# EAGLE design power (EAGLE 6.6.0)

## Sheet 1 of 2
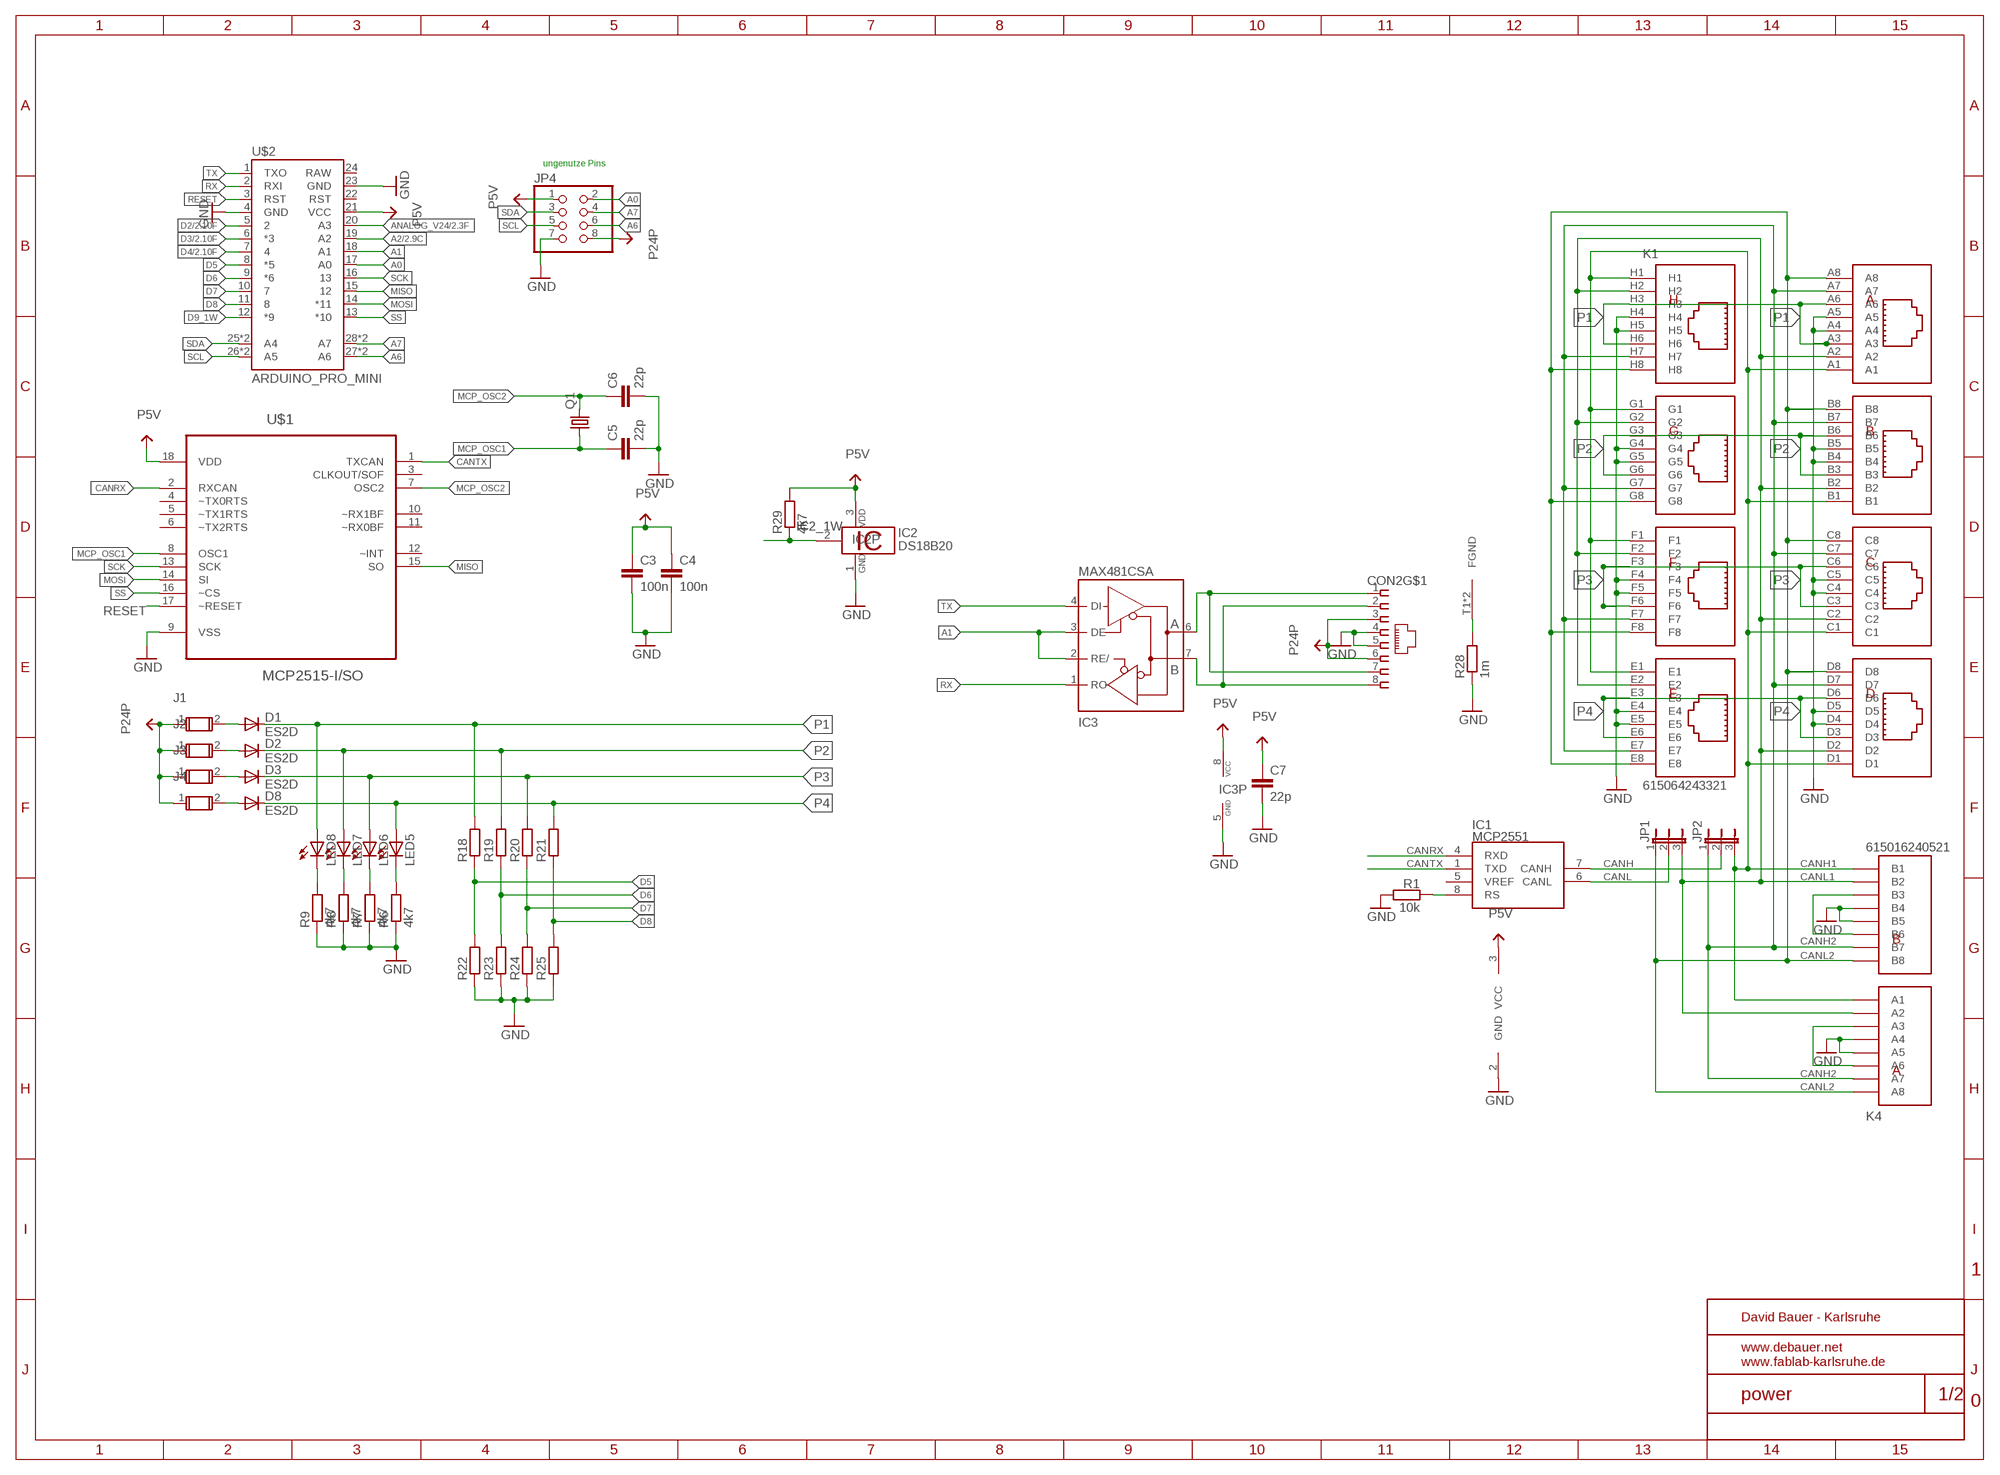
[diagram p0: schematic, sheet 1]

### Parts
C3  100n  C-EUC0805  [C0805]
C4  100n  C-EUC0805  [C0805]
C5  22p  C-EUC0805  [C0805]
C6  22p  C-EUC0805  [C0805]
C7  22p  C-EUC0805  [C0805]
CON2  MEBP_8-8G  [MEBP]
D1  ES2D  [SMB]
D2  ES2D  [SMB]
D3  ES2D  [SMB]
D8  ES2D  [SMB]
IC1  MCP2551  [SO-8]
IC2  DS18B20  [TO92-]
IC3  MAX481CSA  [SO08]
J1  696101000002  [696101000002]
J2  696101000002  [696101000002]
J3  696101000002  [696101000002]
J4  696101000002  [696101000002]
JP1  JP2E  [JP2]
JP2  JP2E  [JP2]
JP4  PINHD-2X4  [2X04]
K1  615064243321  [615064243321]
K4  615016240521  [615016240521]
LED5  LED3MM  [LED3MM]
LED6  LED3MM  [LED3MM]
LED7  LED3MM  [LED3MM]
LED8  LED3MM  [LED3MM]
Q1  CRYSTALHC49S  [HC49/S]
R1  10k  R-EU_R0603  [R0603]
R6  4k7  R-EU_R0805  [R0805]
R7  4k7  R-EU_R0805  [R0805]
R8  4k7  R-EU_R0805  [R0805]
R9  4k7  R-EU_R0805  [R0805]
R18  R-EU_R0805  [R0805]
R19  R-EU_R0805  [R0805]
R20  R-EU_R0805  [R0805]
R21  R-EU_R0805  [R0805]
R22  R-EU_R0805  [R0805]
R23  R-EU_R0805  [R0805]
R24  R-EU_R0805  [R0805]
R25  R-EU_R0805  [R0805]
R28  1m  R-EU_R0805  [R0805]
R29  4k7  R-EU_R0805  [R0805]
U$1  MCP2515-I/SO  [SOIC127P1034X264-18N]
U$2  ARDUINO_PRO_MINI  [ARDUINO_PRO_MINI]

### Nets
A0: JP4.2 U$2.17(A0)
A1: IC3.2(RE/) IC3.3(DE) U$2.18(A1)
A2: U$2.19(A2) ; also sheet 2
A6: JP4.6 U$2.27(A6) U$2.A6
A7: JP4.4 U$2.28(A7) U$2.A7
ANALOG_V24: U$2.20(A3) ; also sheet 2
CANH: IC1.7(CANH) JP2.2
CANH1: JP2.3 K1.A1 K1.B1 K1.C1 K1.D1 K1.E1 K1.F1 K1.G1 K1.H1 K4.A1 K4.B1
CANH2: JP2.1 K1.A7 K1.B7 K1.C7 K1.D7 K1.E7 K1.F7 K1.G7 K1.H7 K4.A7 K4.B7
CANL: IC1.6(CANL) JP1.2
CANL1: JP1.3 K1.A2 K1.B2 K1.C2 K1.D2 K1.E2 K1.F2 K1.G2 K1.H2 K4.A2 K4.B2
CANL2: JP1.1 K1.A8 K1.B8 K1.C8 K1.D8 K1.E8 K1.F8 K1.G8 K1.H8 K4.A8 K4.B8
CANRX: IC1.4(RXD) U$1.2(RXCAN)
CANTX: IC1.1(TXD) U$1.1(TXCAN)
D2: U$2.5 ; also sheet 2
D3: U$2.6(*3) ; also sheet 2
D4: U$2.7 ; also sheet 2
D5: R18.1 R22.2 U$2.8(*5)
D6: R19.1 R23.2 U$2.9(*6)
D7: R20.1 R24.2 U$2.10
D8: R21.1 R25.2 U$2.11
D9_1W: IC2.2 R29.1 U$2.12(*9)
GND: C3.2 C4.2 C5.2 C6.2 C7.2 CON2.4 CON2.5 IC1.2(GND) IC2.1 IC3.5(GND) JP4.7 K1.A4 K1.A5 K1.B4 K1.B5 K1.C4 K1.C5 K1.D4 K1.D5 K1.E4 K1.E5 K1.F4 K1.F5 K1.G4 K1.G5 K1.H4 K1.H5 K4.A4 K4.A5 K4.B4 K4.B5 R1.2 R6.1 R7.1 R8.1 R9.1 R22.1 R23.1 R24.1 R25.1 R28.1 U$1.9(VSS) U$2.4(GND) U$2.23(GND) ; also sheet 2
MCP_OSC1: C5.1 Q1.1 U$1.8(OSC1)
MCP_OSC2: C6.1 Q1.2 U$1.7(OSC2)
MISO: U$1.15(SO) U$2.15
MOSI: U$1.14(SI) U$2.14(*11)
N$1: IC1.8(RS) R1.1
N$2: K4.B3 K4.B6
N$3: CON2.T1(FGND) CON2.T2(FGND) R28.2
N$5: D1.A J1.2
N$6: K4.A3 K4.A6
N$7: D2.A J2.2
N$12: D3.A J3.2
N$20: LED5.K(C) R6.2
N$21: LED6.K(C) R7.2
N$22: D8.A J4.2
N$23: LED7.K(C) R8.2
N$24: LED8.K(C) R9.2
P1: D1.C K1.A3 K1.A6 K1.H3 K1.H6 LED8.A R18.2
P2: D2.C K1.B3 K1.B6 K1.G3 K1.G6 LED7.A R19.2
P3: D3.C K1.C3 K1.C6 K1.F3 K1.F6 LED6.A R20.2
P4: D8.C K1.D3 K1.D6 K1.E3 K1.E6 LED5.A R21.2
P5V: C3.1 C4.1 C7.1 IC1.3(VCC) IC2.3 IC3.8(VCC) JP4.1 R29.2 U$1.18(VDD) U$2.21(VCC) ; also sheet 2
P24P: CON2.3 CON2.6 J1.1 J2.1 J3.1 J4.1 JP4.8 ; also sheet 2
RESET: U$1.17(~RESET) U$2.3(RST)
RS485_A: CON2.1 CON2.7 IC3.6(A)
RS485_B: CON2.2 CON2.8 IC3.7(B)
RX: IC3.1(RO) U$2.2(RXI)
SCK: U$1.13(SCK) U$2.16
SCL: JP4.5 U$2.26(A5) U$2.A5
SDA: JP4.3 U$2.25(A4) U$2.A4
SS: U$1.16(~CS) U$2.13(*10)
TX: IC3.4(DI) U$2.1(TXO)
Unconnected: IC1.5(VREF) U$1.3(CLKOUT/SOF) U$1.4(~TX0RTS) U$1.5(~TX1RTS) U$1.6(~TX2RTS) U$1.10(~RX1BF) U$1.11(~RX0BF) U$1.12(~INT) U$2.22(RST) U$2.24(RAW)

### Notes on the sheet
- ungenutze Pins

## Sheet 2 of 2
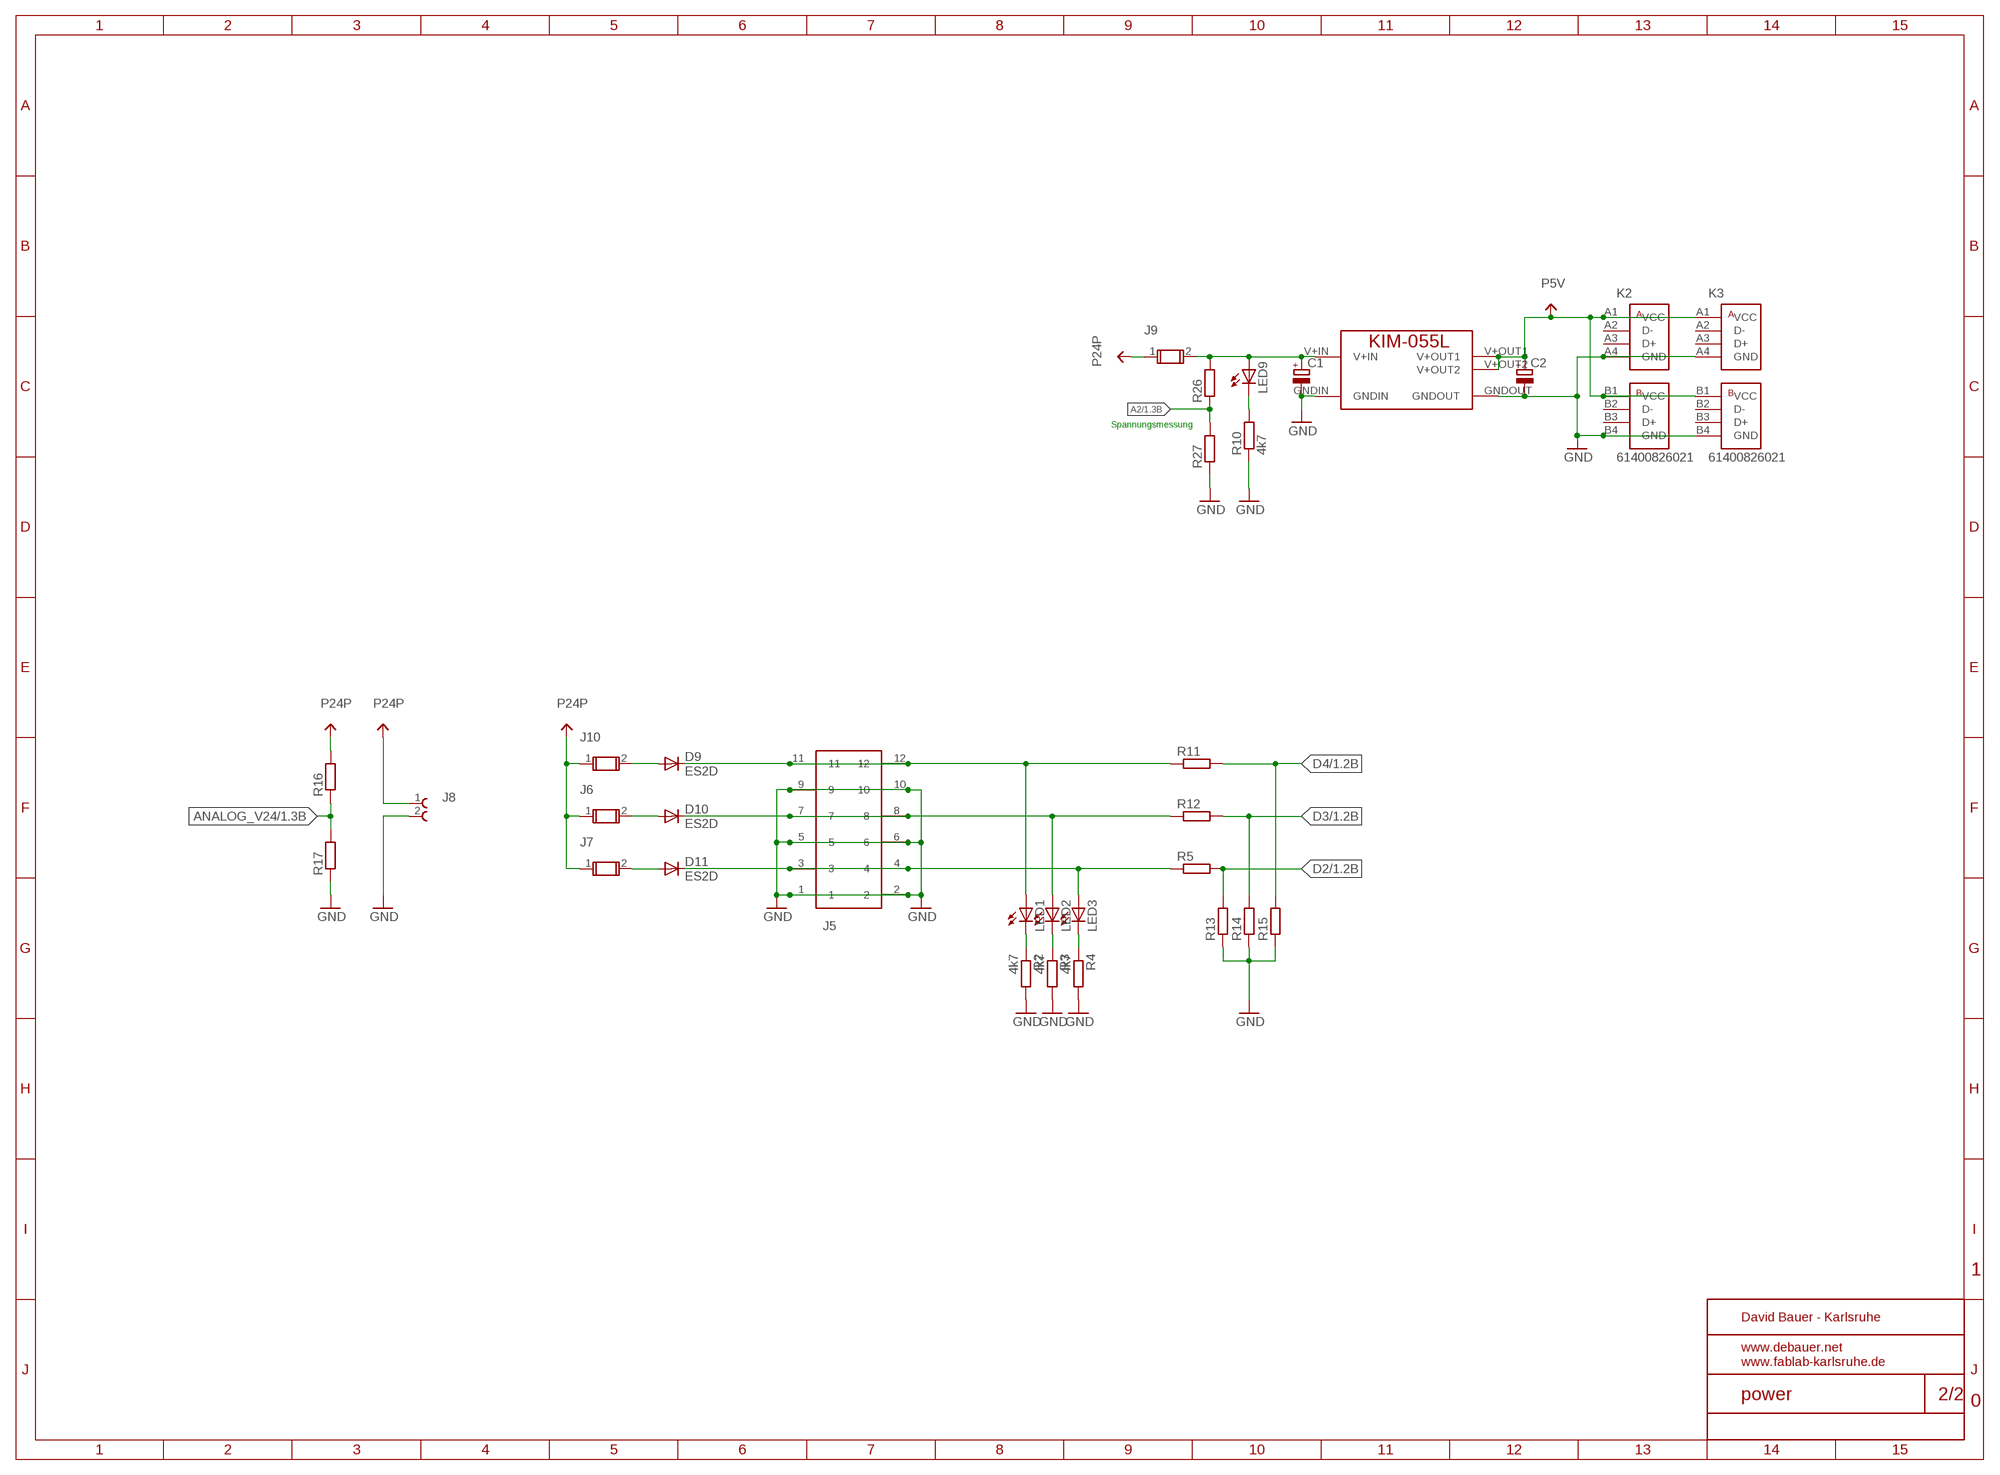
[diagram p1: schematic, sheet 2]

### Parts
C1  CPOL-EUE5-10.5  [E5-10,5]
C2  CPOL-EUE5-10.5  [E5-10,5]
D9  ES2D  [SMB]
D10  ES2D  [SMB]
D11  ES2D  [SMB]
J5  691332510012  [691332510012]
J6  696101000002  [696101000002]
J7  696101000002  [696101000002]
J8  691312510002  [691312510002]
J9  696101000002  [696101000002]
J10  696101000002  [696101000002]
K2  61400826021  [61400826021]
K3  61400826021  [61400826021]
LED1  LED3MM  [LED3MM]
LED2  LED3MM  [LED3MM]
LED3  LED3MM  [LED3MM]
LED9  LED3MM  [LED3MM]
MOD1  KIM-055L  [KIM-055L]
R2  4k7  R-EU_R0805  [R0805]
R3  4k7  R-EU_R0805  [R0805]
R4  4k7  R-EU_R0805  [R0805]
R5  R-EU_R0805  [R0805]
R10  4k7  R-EU_R0805  [R0805]
R11  R-EU_R0805  [R0805]
R12  R-EU_R0805  [R0805]
R13  R-EU_R0805  [R0805]
R14  R-EU_R0805  [R0805]
R15  R-EU_R0805  [R0805]
R16  R-EU_R0805  [R0805]
R17  R-EU_R0805  [R0805]
R26  R-EU_R0805  [R0805]
R27  R-EU_R0805  [R0805]

### Nets
A2: R26.1 R27.2 ; also sheet 1
ANALOG_V24: R16.1 R17.2 ; also sheet 1
D2: R5.2 R13.2 ; also sheet 1
D3: R12.2 R14.2 ; also sheet 1
D4: R11.2 R15.2 ; also sheet 1
GND: C1.- C2.- J5.1 J5.2 J5.5 J5.6 J5.9 J5.10 J8.2 K2.A4(GND) K2.B4(GND) K3.A4(GND) K3.B4(GND) MOD1.GNDIN MOD1.GNDOUT R2.2 R3.2 R4.2 R10.1 R13.1 R14.1 R15.1 R17.1 R27.1 ; also sheet 1
N$4: C1.+ J9.2 LED9.A MOD1.V+IN R26.2
N$9: LED9.K(C) R10.2
N$10: D9.A J10.2
N$11: D11.A J7.2
N$13: LED1.K(C) R2.1
N$14: LED2.K(C) R3.1
N$15: LED3.K(C) R4.1
N$26: D10.A J6.2
N$29: D9.C J5.11 J5.12 LED1.A R11.1
N$30: D10.C J5.7 J5.8 LED2.A R12.1
N$31: D11.C J5.3 J5.4 LED3.A R5.1
P5V: C2.+ K2.A1(VCC) K2.B1(VCC) K3.A1(VCC) K3.B1(VCC) MOD1.V+OUT1 MOD1.V+OUT2 ; also sheet 1
P24P: J6.1 J7.1 J8.1 J9.1 J10.1 R16.2 ; also sheet 1
Unconnected: K2.A2(D-) K2.A3(D+) K2.B2(D-) K2.B3(D+) K3.A2(D-) K3.A3(D+) K3.B2(D-) K3.B3(D+)

### Notes on the sheet
- Spannungsmessung

## Library data of the parts
C1 C2 = schlager_passiv:CPOL-EU: POLARIZED CAPACITOR, European symbol
C3-C7 = schlager_passiv:C-EU: CAPACITOR, European symbol
CON2 = myconn:MEBP_8-8G: Reichelt RJ45 geschirmt MEBP 8-8G
D1-D3 D8-D11 = schlager_dioden:ES2D: DIODE super fast rectifier, 2 A; MPN: ES2D; OC_ELBE: 01.41.0013.0; OC_FARNELL: 1625037; SUPPLIER: Multicomp
IC1 = MYMCHIP:MCP2551: CAN Transceiver
IC2 = 1wire:DS18B20: Programmable Resolution Digital Thermometer This chip provides a onewire thermosensor with approx. 0.5°C accuracy. A programmable over/undertemperure alarm is available. The precision can be set from 9..12 bits. Notes: Vdd must be applied for accurate measurements at low temperatures, as the parasite power circuit otherwise heats the sensor. If parasite power is used, Vdd has to be connected to GND. The DS1822 is a low-cost thermometer chip, the DS18S20 is similar to the DS18B20, but with 9 Bit precision only. Author: Jan Kandziora <jjj@gmx.de>
IC3 = maxim:MAX481CSA: RS485 TRANSEIVER; MF: MAXIM; MPN: MAX481CSA; OC_FARNELL: unknown; OC_NEWARK: 90C3817
J1-J4 J6 J7 J9 J10 = Eagle_FUSEHOLDERS_rev16a:696101000002: WR-FSH PTF/15 FUSEHOLDER BLOCKS - PCB - CLIP COVER - THT ;=>Code : Con_FSH_Blocks_696101000002_696101000002 <http://katalog.we-online.de/media/images/eican/Con_FSH_Blocks_696101000002_pf2.jpg> Details see: http://katalog.we-online.de/em/datasheet/696101000002.pdf Created 2014-10-08, Karrer Zheng 2014 (C) Wurth Elektronik
J5 = Eagle_TERMINAL_BLOCKS_rev16a:691332510012: WR-TBL Serie 3325 – 5.08mm Close Horizontal Dual Row PCB Header With Flanges, 12 Pins=>Code : Con_TBL_Pluggable_5.08_PCB_THT_Double_H_691332510012 <http://katalog.we-online.de/media/images/eican/Con_TBL_Pluggable_5.08_PCB_THT_Double_H_6913325100xx_pf2.jpg> Details see: http://katalog.we-online.de/en/em/691_332_510_0xx Created 2014-06-25, Karrer Zheng 2014 (C) Würth Elektronik
J8 = Eagle_TERMINAL_BLOCKS_rev16a:691312510002: WR-TBL Serie 312 - 5.08 mm Open Horizontal PCB Header , 2 Pins=>Code : Con_TBL_Pluggable_5.08_PCB_THT_Simple_H_691312510002 <http://katalog.we-online.de/media/images/eican/Con_TBL_Pluggable_5.08_PCB_THT_Simple_H_6913125100xx_pf2.jpg> Details see: http://katalog.we-online.de/en/em/691_312_510_0xx Created 2014-06-25, Karrer Zheng 2014 (C) Würth Elektronik
JP1 JP2 = jumper:JP2E: JUMPER
JP4 = pinhead:PINHD-2X4: PIN HEADER
K1 = Wuerth_Speicherkarten-SockelWR-CRD:615064243321: WR-MJ Horizontal Shielded 2 x 4 Stacked Port with EMI Panel Finger 8P8C Modular Jack Tab Up & Down, 64 Pins=>Code : Con-I-O_MJ-H_Shielded_Up-Down_615064243321 <http://katalog.we-online.de/media/images/eican/Con-I-O_MJ-H_Shielded_Up-Down_615064243321_pf2.jpg> Details see: http://katalog.we-online.de/en/em/615_064_243_321 Created 2014-07-10, Karrer Zheng 2014 (C) Würth Elektronik
K2 K3 = Wuerth_Speicherkarten-SockelWR-CRD:61400826021: WR-COM Horizontal Dual Stacked USB Type A=>Code : Con_I-O_COM_USB-2.0_A_61400826021 <http://katalog.we-online.de/media/images/eican/Con_I-O_COM_USB-2.0_A_61400826021_pf2.jpg> Details see: http://katalog.we-online.de/en/em/614_008_260_21 Created 2014-07-09, Karrer Zheng 2014 (C) Würth Elektronik
K4 = Wuerth_Elektronik_eiCan_Communication_Connectors:615016240521: WR-MJ Horizontal Shielded Dual Stacked Port with EMI Panel Finger 8P8C Modular Jack Tab Up & Down, 16 Pins
LED1-LED3 LED5-LED9 = led:LED: LED OSRAM: - CHIPLED LG R971, LG N971, LY N971, LG Q971, LY Q971, LO R971, LY R971 LH N974, LH R974 LS Q976, LO Q976, LY Q976 LO Q996 - Hyper CHIPLED LW Q18S LB Q993, LB Q99A, LB R99A - SideLED LS A670, LO A670, LY A670, LG A670, LP A670 LB A673, LV A673, LT A673, LW A673 LH A674 LY A675 LS A676, LA A676, LO A676, LY A676, LW A676 LS A679, LY A679, LG A679 - Hyper Micro SIDELED® LS Y876, LA Y876, LO Y876, LY Y876 LT Y87S - SmartLED LW L88C, LW L88S LB L89C, LB L89S, LG L890 LS L89K, LO L89K, LY L89K LS L896, LA L896, LO L896, LY L896 - TOPLED LS T670, LO T670, LY T670, LG T670, LP T670 LSG T670, LSP T670, LSY T670, LOP T670, LYG T670 LG T671, LOG T671, LSG T671 LB T673, LV T673, LT T673, LW T673 LH T674 LS T676, LA T676, LO T676, LY T676, LB T676, LH T676, LSB T676, LW T676 LB T67C, LV T67C, LT T67C, LS T67K, LO T67K, LY T67K, LW E67C LS E67B, LA E67B, LO E67B, LY E67B, LB E67C, LV E67C, LT E67C LW T67C LS T679, LY T679, LG T679 LS T770, LO T770, LY T770, LG T770, LP T770 LB T773, LV T773, LT T773, LW T773 LH T774 LS E675, LA E675, LY E675, LS T675 LS T776, LA T776, LO T776, LY T776, LB T776 LHGB T686 LT T68C, LB T68C - Hyper Mini TOPLED® LB M676 - Mini TOPLED Santana® LG M470 LS M47K, LO M47K, LY M47K Source: http://www.osram.convergy.de LUXEON: - LUMILED® LXK2-PW12-R00, LXK2-PW12-S00, LXK2-PW14-U00, LXK2-PW14-V00 LXK2-PM12-R00, LXK2-PM12-S00, LXK2-PM14-U00 LXK2-PE12-Q00, LXK2-PE12-R00, LXK2-PE12-S00, LXK2-PE14-T00, LXK2-PE14-U00 LXK2-PB12-K00, LXK2-PB12-L00, LXK2-PB12-M00, LXK2-PB14-N00, LXK2-PB14-P00, LXK2-PB14-Q00 LXK2-PR12-L00, LXK2-PR12-M00, LXK2-PR14-Q00, LXK2-PR14-R00 LXK2-PD12-Q00, LXK2-PD12-R00, LXK2-PD12-S00 LXK2-PH12-R00, LXK2-PH12-S00 LXK2-PL12-P00, LXK2-PL12-Q00, LXK2-PL12-R00 Source: www.luxeon.com KINGBRIGHT: KA-3528ASYC Source: www.kingbright.com
MOD1 = kim055l:KIM-055L: 5V 5amp DC DC module. IMPORANT: Add low ESR input & output capacitors. V+OUT1 & V+OUT2 internally connected.
Q1 = crystal:CRYSTAL: CRYSTAL; OC_FARNELL: 1667008; OC_NEWARK: unknown
R1 = rcl:R-EU_: RESISTOR, European symbol
R2-R29 = schlager_passiv:R-EU_: RESISTOR, European symbol
U$1 = schlager_ics:MCP2515-I/SO: CAN Controller; MPN: MCP2515-I/SO; OC_FARNELL: 1292239; OC_NEWARK: 29H7136; PACKAGE: SOIC-18; SUPPLIER: Microchip
U$2 = debauer_modules:ARDUINO_PRO_MINI

## Board
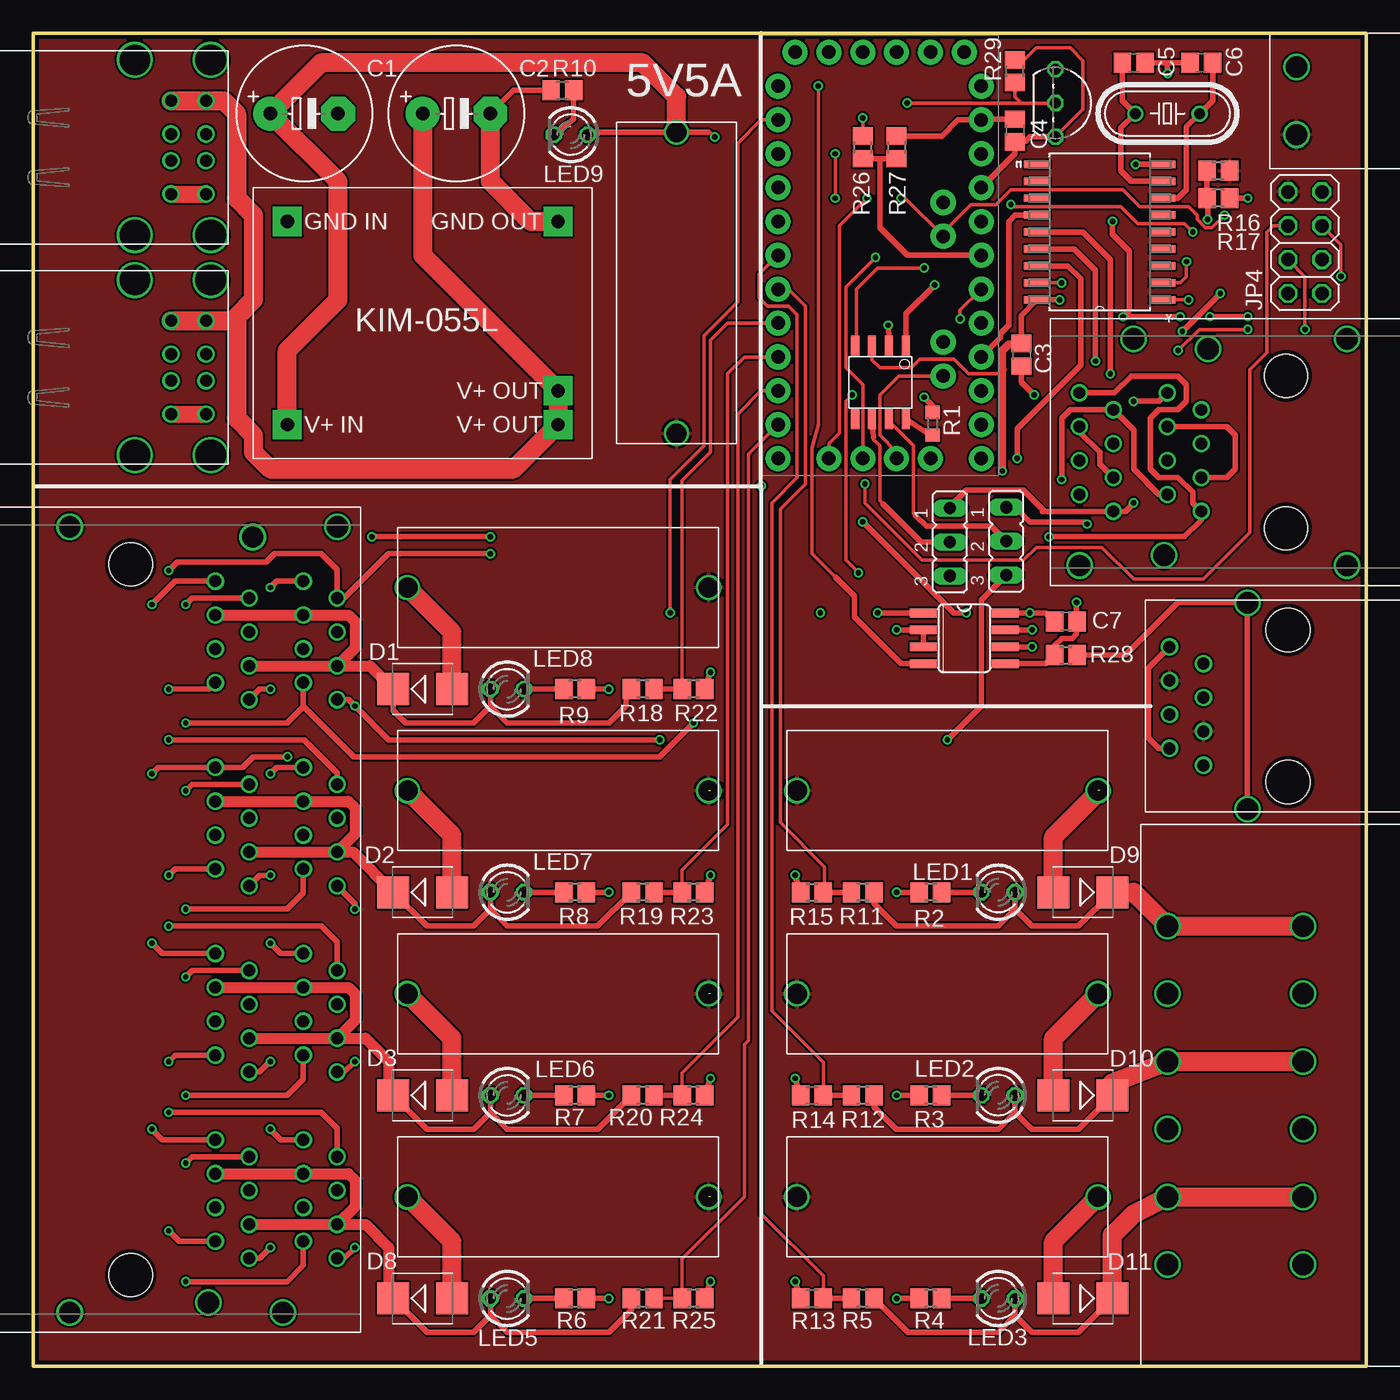
[diagram p2: board, top side]
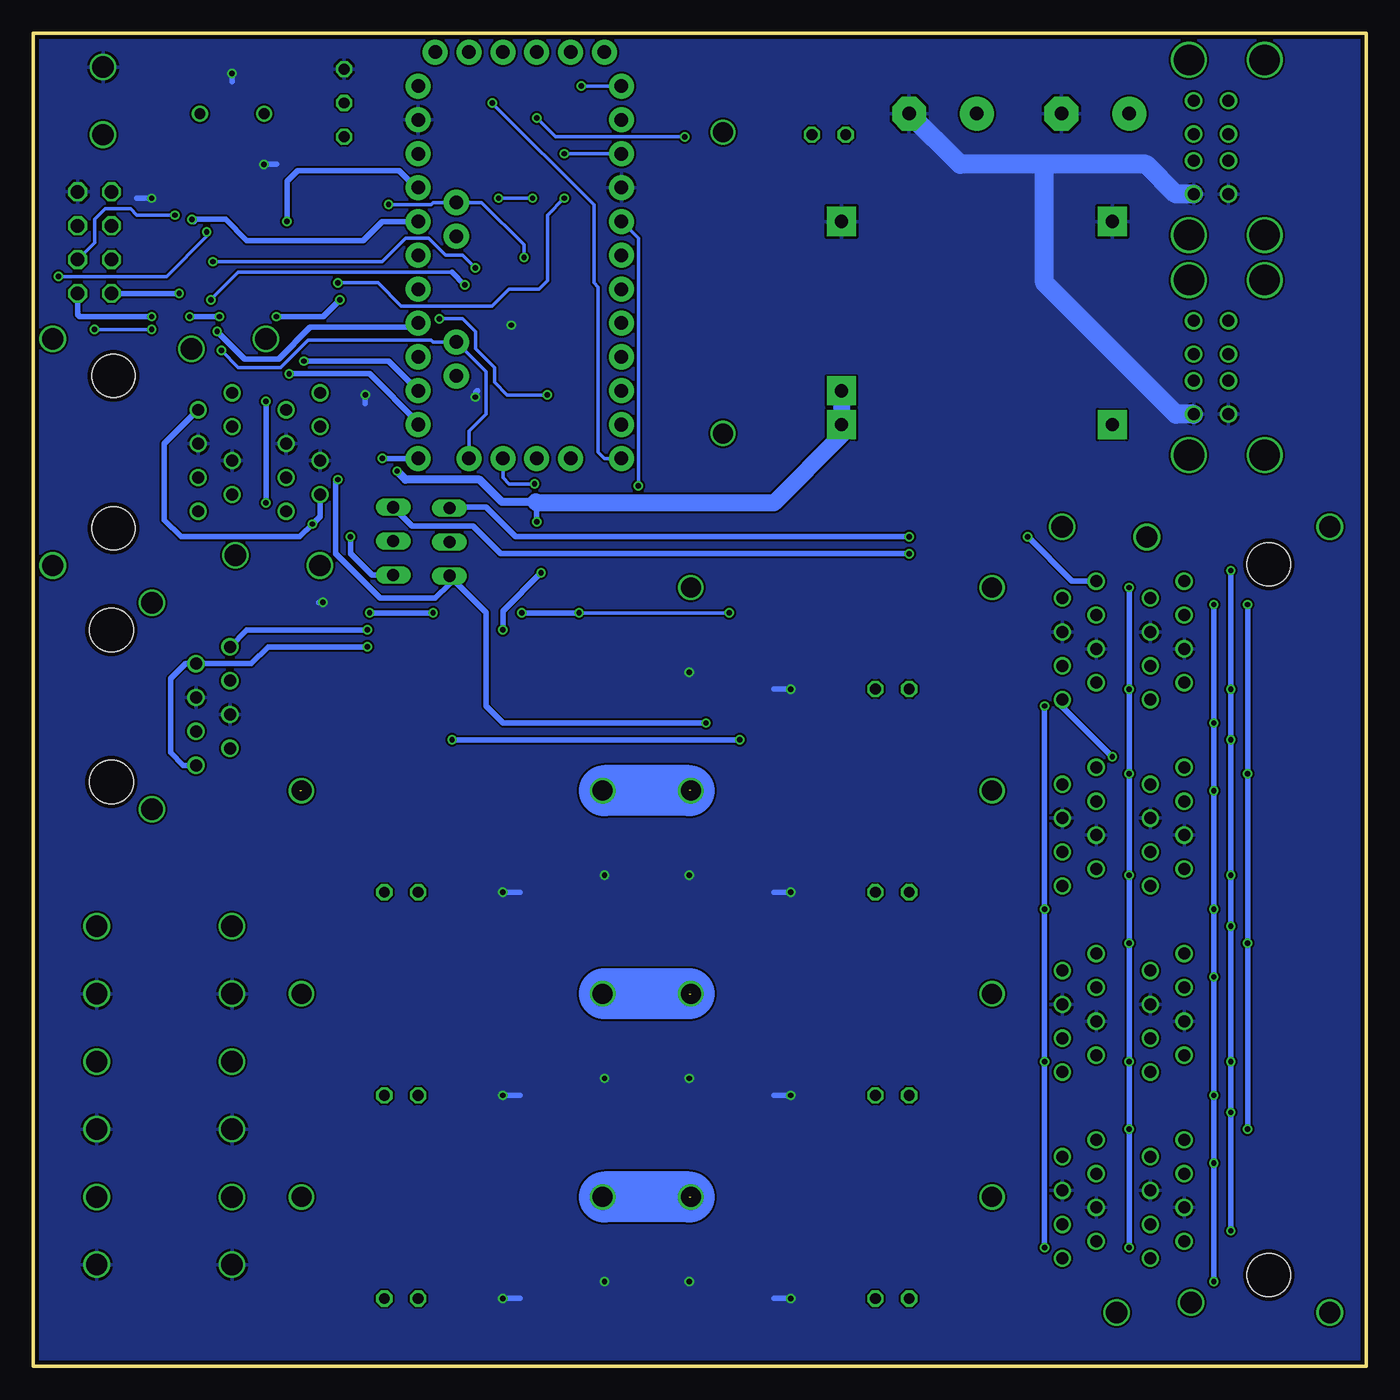
[diagram p3: board, bottom side, seen from below]

Size 100 x 100 mm. Coordinates in mm from the lower left corner, seen from the top.
Outline: 0,0 0,100 100,100 100,0 0,0
Copper layers (1*16): Top 0.035mm / dielectric 1.5mm / Bottom 0.035mm
Design rules "PCB-POOL Standard": minimum track width 0.15mm, minimum drill 0.3mm, track to track 0.15mm, track to pad 0.15mm, pad to pad 0.15mm, via to via 0.15mm, smd to smd 0.15mm, copper to edge 0.3mm, drill to drill 0.2mm, minimum pad ring 0.2mm, minimum via ring 0.15mm, stop-mask expansion 0.075mm, vias tented up to drill 0mil, thermal gap 0.2mm

### Footprints (pad centres in the part's own frame; a part is rotated, then mirrored left to right if it is on the bottom)
E5-10,5 = drill 1.016 pad 2.54: + -2.54,0 | drill 1.016 pad 2.54 octagon: - 2.54,0
C0805 = smd 1.3 x 1.5: 1 -0.85,0; 2 0.85,0
MEBP = drill 0.9: 1 -4.445,6.35; 2 -3.175,8.89; 3 -1.9,6.35; 4 -0.635,8.89; 5 0.635,6.35; 6 1.9,8.89; 7 3.175,6.35; 8 4.445,8.89 | drill 1.6: T1 -7.75,3.05; T2 7.75,3.05 | hole 3.3: -5.7,0; 5.7,0
SMB = smd 2.4 x 2.4: A 2.2,0; C -2.2,0
SO-8 = smd 0.61 x 1.524: 1 0,-0.203; 2 1.27,-0.203; 3 2.54,-0.203; 4 3.81,-0.203; 5 3.81,5.283; 6 2.54,5.283; 7 1.27,5.283; 8 0,5.283
TO92- = drill 0.813 octagon: 1 -2.54,0; 2 0,0; 3 2.54,0
SO08 = smd 0.66 x 2.032: 1 -1.905,-3.073; 2 -0.635,-3.073; 3 0.635,-3.073; 4 1.905,-3.073; 5 1.905,3.073; 6 0.635,3.073; 7 -0.635,3.073; 8 -1.905,3.073
696101000002 = drill 1.5: 1 -11.3,0; 2 11.3,0
691332510012 = drill 1.6: 1 0,0; 2 10.16,0; 3 0,5.08; 4 10.16,5.08; 5 0,10.16; 6 10.16,10.16; 7 0,15.24; 8 10.16,15.24; 9 0,20.32; 10 10.16,20.32; 11 0,25.4; 12 10.16,25.4
691312510002 = drill 1.6: 1 -5.08,0; 2 0,0
JP2 = drill 0.914 long: 1 -2.54,0; 2 0,0; 3 2.54,0
2X04 = drill 1.016 octagon: 1 -3.81,-1.27; 2 -3.81,1.27; 3 -1.27,-1.27; 4 -1.27,1.27; 5 1.27,-1.27; 6 1.27,1.27; 7 3.81,-1.27; 8 3.81,1.27
615064243321 = drill 0.9: A1 -16.51,0.885; A2 -17.78,-1.655; A3 -19.05,0.885; A4 -20.32,-1.655; A5 -21.59,0.885; A6 -22.86,-1.655; A7 -24.13,0.885; A8 -25.4,-1.655; B1 -2.54,0.885; B2 -3.81,-1.655; B3 -5.08,0.885; B4 -6.35,-1.655; B5 -7.62,0.885; B6 -8.89,-1.655; B7 -10.16,0.885; B8 -11.43,-1.655; C1 11.43,0.885; C2 10.16,-1.655; C3 8.89,0.885; C4 7.62,-1.655; C5 6.35,0.885; C6 5.08,-1.655; C7 3.81,0.885; C8 2.54,-1.655; D1 25.4,0.885; D2 24.13,-1.655; D3 22.86,0.885; D4 21.59,-1.655; D5 20.32,0.885; D6 19.05,-1.655; D7 17.78,0.885; D8 16.51,-1.655; E1 16.51,-8.255; E2 17.78,-5.715; E3 19.05,-8.255; E4 20.32,-5.715; E5 21.59,-8.255; E6 22.86,-5.715; E7 24.13,-8.255; E8 25.4,-5.715; F1 2.54,-8.255; F2 3.81,-5.715; F3 5.08,-8.255; F4 6.35,-5.715; F5 7.62,-8.255; F6 8.89,-5.715; F7 10.16,-8.255; F8 11.43,-5.715; G1 -11.43,-8.255; G2 -10.16,-5.715; G3 -8.89,-8.255; G4 -7.62,-5.715; G5 -6.35,-8.255; G6 -5.08,-5.715; G7 -3.81,-8.255; G8 -2.54,-5.715; H1 -25.4,-8.255; H2 -24.13,-5.715; H3 -22.86,-8.255; H4 -21.59,-5.715; H5 -20.32,-8.255; H6 -19.05,-5.715; H7 -17.78,-8.255; H8 -16.51,-5.715 | drill 1.6: Z1 -29.47,-19.175; Z2 -28.71,-5.455; Z3 -29.47,0.895; Z4 29.47,-3.175; Z5 28.71,-8.765; Z6 29.47,-19.175 | hole 3.25: -26.67,-14.605; 26.67,-14.605
61400826021 = drill 2.3: 5 -6.57,5.68; 6 -6.57,0; 7 6.57,0; 8 6.57,5.68 | drill 0.9: A1 -3.5,5.33; A2 -1,5.33; A3 1,5.33; A4 3.5,5.33; B1 -3.5,2.71; B2 -1,2.71; B3 1,2.71; B4 3.5,2.71
615016240521 = drill 0.89: A1 -4.445,-1.27; A2 -3.175,1.27; A3 -1.905,-1.27; A4 -0.635,1.27; A5 0.635,-1.27; A6 1.905,1.27; A7 3.175,-1.27; A8 4.445,1.27; B1 4.445,7.87; B2 3.175,5.33; B3 1.905,7.87; B4 0.635,5.33; B5 -0.635,7.87; B6 -1.905,5.33; B7 -3.175,7.87; B8 -4.445,5.33 | drill 1.6: Z1 -8.505,-12.19; Z2 8.505,-12.19; Z3 7.745,-1.78; Z4 -7.745,1.52; Z5 8.505,3.81; Z6 -8.505,7.87 | hole 3.25: -5.715,-7.62; 5.715,-7.62
LED3MM = drill 0.813 octagon: A -1.27,0; K 1.27,0
KIM-055L = drill 1 pad 2.184 square: GNDIN -10.16,7.62; GNDOUT 10.16,7.62; V+IN -10.16,-7.62; V+OUT1 10.16,-5.08; V+OUT2 10.16,-7.62
HC49/S = drill 0.813: 1 -2.413,0; 2 2.413,0
R0603 = smd 1 x 1.1: 1 -0.85,0; 2 0.85,0
R0805 = smd 1.3 x 1.5: 1 -0.85,0; 2 0.85,0
SOIC127P1034X264-18N = smd 1.981 x 0.559: 1 -4.699,5.08; 2 -4.699,3.81; 3 -4.699,2.54; 4 -4.699,1.27; 5 -4.699,0; 6 -4.699,-1.27; 7 -4.699,-2.54; 8 -4.699,-3.81; 9 -4.699,-5.08; 10 4.699,-5.08; 11 4.699,-3.81; 12 4.699,-2.54; 13 4.699,-1.27; 14 4.699,0; 15 4.699,1.27; 16 4.699,2.54; 17 4.699,3.81; 18 4.699,5.08
ARDUINO_PRO_MINI = drill 1.016 pad 1.88: 1 -7.62,12.7; 2 -7.62,10.16; 3 -7.62,7.62; 4 -7.62,5.08; 5 -7.62,2.54; 6 -7.62,0; 7 -7.62,-2.54; 8 -7.62,-5.08; 9 -7.62,-7.62; 10 -7.62,-10.16; 11 -7.62,-12.7; 12 -7.62,-15.24; 13 7.62,-15.24; 14 7.62,-12.7; 15 7.62,-10.16; 16 7.62,-7.62; 17 7.62,-5.08; 18 7.62,-2.54; 19 7.62,0; 20 7.62,2.54; 21 7.62,5.08; 22 7.62,7.62; 23 7.62,10.16; 24 7.62,12.7; 25 -3.81,-15.24; 26 -1.27,-15.24; 27 1.27,-15.24; 28 3.81,-15.24; A4 4.763,1.429; A5 4.763,3.969; A6 4.763,-9.049; A7 4.763,-6.509; BLK -6.35,15.24; GND -3.81,15.24; GRN 6.35,15.24; RXI 1.27,15.24; TXO 3.81,15.24; VCC -1.27,15.24

### Placement (x,y rotation side)
C1  20.32,93.98 0 top
C2  31.75,93.98 0 top
C3  74.14,75.88 270 top
C4  73.66,92.71 90 top
C5  82.55,97.79 0 top
C6  87.63,97.79 180 top
C7  77.47,55.88 0 top
CON2  94.14,49.53 90 top
D1  29.21,50.8 0 top
D2  29.21,35.56 0 top
D3  29.21,20.32 0 top
D8  29.21,5.08 0 top
D9  78.74,35.56 180 top
D10  78.74,20.32 180 top
D11  78.74,5.08 180 top
IC1  65.47,76.35 180 top
IC2  76.68,94.77 270 top
IC3  69.85,54.61 270 top
J1  39.37,58.42 180 top
J2  39.37,43.18 180 top
J3  39.37,27.94 180 top
J4  39.37,12.7 180 top
J5  85.09,7.62 0 top
J6  68.58,27.94 0 top
J7  68.58,12.7 0 top
J8  94.77,97.47 90 top
J9  48.26,81.28 90 top
J10  68.58,43.18 0 top
JP1  68.78,61.84 270 top
JP2  73,61.9 270 top
JP4  95.41,84.3 90 top
K1  21.91,33.5 270 top
K2  7.62,74.93 270 top
K3  7.62,91.44 270 top
K4  86.36,68.58 90 top
LED1  72.39,35.56 180 top
LED2  72.39,20.32 180 top
LED3  72.39,5.08 180 top
LED5  35.56,5.08 0 top
LED6  35.56,20.32 0 top
LED7  35.56,35.56 0 top
LED8  35.56,50.8 0 top
LED9  40.32,92.39 180 top
MOD1  29.21,78.26 0 top
Q1  85.09,93.98 0 top
R1  67.47,70.71 90 top
R2  67.31,35.56 180 top
R3  67.31,20.32 180 top
R4  67.31,5.08 180 top
R5  62.23,5.08 180 top
R6  40.64,5.08 180 top
R7  40.64,20.32 180 top
R8  40.64,35.56 180 top
R9  40.64,50.8 180 top
R10  39.69,95.73 0 top
R11  62.23,35.56 180 top
R12  62.23,20.32 180 top
R13  58.42,5.08 0 top
R14  58.42,20.32 0 top
R15  58.42,35.56 0 top
R16  88.9,89.69 0 top
R17  88.9,87.63 180 top
R18  45.72,50.8 180 top
R19  45.72,35.56 180 top
R20  45.72,20.32 180 top
R21  45.72,5.08 180 top
R22  49.53,50.8 180 top
R23  49.53,35.56 180 top
R24  49.53,20.32 180 top
R25  49.53,5.08 180 top
R26  62.23,91.44 90 top
R27  64.77,91.44 270 top
R28  77.47,53.34 0 top
R29  73.66,97.16 90 top
U$1  80.01,85.09 180 top
U$2  63.5,83.34 0 top

### Tracks (layer width: path | path; a pad name or v marks a point on that pad's centre or on a via)
A0  (via drill 0.4)
  Top 0.406: v89.06,80.49 v86.2,77.63
  Bottom 0.406: v86.2,77.63 84.14,75.56 81.6,75.56 79.22,77.95 71.44,77.95 U$2.17 | v89.06,80.49 JP4.2
A1  (via drill 0.4)
  Top 0.254: v61.91,59.53 60.96,60.48 60.96,72.39 v61.44,72.87 | v69.53,78.58 69.53,79.22 U$2.18
  Top 0.406: IC3.3 IC3.2 v64.77,55.24
  Bottom 0.254: v61.44,72.87 64.45,72.87 65.41,73.82 65.41,74.93 66.83,76.36 66.83,77.63 67.79,78.58 v69.53,78.58
  Bottom 0.406: v64.77,55.24 64.77,56.67 v61.91,59.53
A2
  Top 0.406: R26.1 R27.2 63.6,90.59 63.5,90.49 63.5,85.41 65.56,83.34 U$2.19
A6  (via drill 0.4)
  Top 0.254: U$2.27 64.77,68.58 63.5,69.85 63.5,72.87 64.93,74.3 U$2.A6 | JP4.6 93.03,85.57 92.55,85.09 92.55,76.04 91.28,74.77 91.28,62.55 87.79,59.05 82.55,59.05 80.17,61.44 75.25,61.44 74.3,60.48 66.67,60.48 62.39,64.77 v62.39,66.2
  Bottom 0.254: v62.39,66.2 64.29,66.2 64.77,66.67 U$2.27
A7  (via drill 0.4)
  Top 0.254: v95.41,77.79 95.41,81.76 JP4.4 | v85.88,76.2 87.47,77.79 v91.12,77.79
  Bottom 0.254: v85.88,76.2 84.61,74.93 81.44,74.93 79.38,76.99 70.17,76.99 70.01,76.83 U$2.A7 66.04,74.61 66.04,71.44 67.31,70.17 U$2.28 | v91.12,77.79 v95.41,77.79
ANALOG_V24  (via drill 0.4)
  Top 0.406: R16.1 R17.2 88.11,87.57 v88.11,86.04
  Bottom 0.406: 87.95,85.88 v88.11,86.04 85.57,86.04 83.98,84.45 75.25,84.45 73.82,85.88 U$2.20
CANH
  Top 0.254: IC1.7 64.2,70.9 66.04,69.06 66.04,63.98 66.2,63.82
  Top 0.406: 66.2,63.82 66.99,63.02 71.88,63.02 JP2.2
CANH1  (via drill 0.4)
  Top 0.406: K1.F1 9.68,30.96 v8.89,31.75 | K1.H1 10.64,58.9 v8.89,57.15 | v8.89,44.45 9.37,44.93 K1.G1 15.72,44.93 16.51,45.72 v19.05,45.72 | K1.E1 9.68,16.99 v8.89,17.78 | K1.A1 23.65,50.01 v24.13,49.53 26.67,46.99 v46.99,46.99 | v24.13,34.29 24.13,34.7 K1.B1 | K1.C1 23.34,22.07 v24.13,22.86 | K1.D1 23.34,8.1 v24.13,8.89 | v76.2,62.23 86.36,62.23 87.63,63.5 K4.A1 87,64.77 87,65.56 85.88,66.67 84.45,66.67 83.82,67.31 83.82,71.12 84.45,71.75 85.88,71.75 86.52,72.39 86.52,73.66 85.88,74.3 82.39,74.3 81.12,73.03 K4.B1 | 72.21,59.36 72.47,59.62 | 72.47,59.62 72.54,59.69 | JP2.3 72.72,59.36 72.47,59.62 | 72.21,58.57 JP2.3 | v68.58,46.99 71.12,49.53 71.12,57.48 JP2.3
  Bottom 0.406: v8.89,57.15 v8.89,44.45 v8.89,31.75 v8.89,17.78 | v24.13,49.53 v24.13,34.29 v24.13,22.86 v24.13,8.89 | v19.05,45.72 22.86,49.53 22.86,49.94 K1.A1 | v68.58,46.99 v46.99,46.99 | JP2.3 74.6,59.36 76.2,60.96 v76.2,62.23
CANH2  (via drill 0.4)
  Top 0.406: K1.E7 10.95,9.37 v10.16,10.16 | v10.16,50.8 13.18,50.8 K1.H7 | K1.G7 10.64,37.31 v10.16,36.83 | K1.F7 10.64,23.34 v10.16,22.86 | K1.B7 22.79,44.52 20.32,46.99 v10.16,46.99 | K1.C7 22.79,31.82 21.59,33.02 v10.16,33.02 | K1.D7 22.79,17.85 21.59,19.05 v10.16,19.05 | v10.16,59.69 10.79,60.33 17.46,60.33 18.1,60.96 21.59,60.96 22.79,59.76 K1.A7 23.34,57.63 26.67,60.96 v34.29,60.96 | JP2.1 73.67,64.44 74.77,63.34 78.9,63.34 v79.06,63.18
  Bottom 0.406: v10.16,10.16 v10.16,19.05 v10.16,22.86 v10.16,33.02 v10.16,36.83 v10.16,46.99 v10.16,50.8 v10.16,59.69 | K4.B7 78.49,63.75 78.74,63.5 v79.06,63.18 80.01,62.23 88.9,62.23 90.17,63.5 90.17,69.22 K4.A7 | v34.29,60.96 64.93,60.96 66.99,63.02 71.59,63.02 JP2.1
CANL
  Top 0.254: 63.02,69.7 63.02,69.53 63.5,69.06 63.5,64.93 63.74,64.69
  Top 0.406: JP1.2 66.59,61.84 63.74,64.69 | 63.02,69.7 IC1.6
CANL1  (via drill 0.4)
  Top 0.406: K1.H2 11.91,57.63 v11.43,57.15 | K1.E2 11.91,15.72 v11.43,15.24 | K1.D2 20.25,7.55 19.05,6.35 v11.43,6.35 | K1.C2 20.25,21.52 19.05,20.32 v11.43,20.32 | K1.B2 20.25,35.49 19.05,34.29 v11.43,34.29 | K1.F2 11.91,29.69 v11.43,29.21 | K1.G2 11.91,43.66 v11.43,43.18 | K1.A2 20.25,49.53 | 20.25,49.53 20.25,49.46 19.05,48.26 v11.43,48.26 | K4.A2 84.45,65.41 82.55,67.31 82.55,70.23 K4.B2 77.79,71.75 77.15,71.12 v77.15,66.52 | v49.53,48.26 46.99,45.72 24.06,45.72 20.25,49.53
  Bottom 0.406: v11.43,57.15 v11.43,48.26 v11.43,43.18 v11.43,34.29 v11.43,29.21 v11.43,20.32 v11.43,15.24 v11.43,6.35 | v49.53,48.26 64.77,48.26 66.04,49.53 66.04,56.56 JP1.3 68.78,58.7 69.85,57.63 73.98,57.63 77.31,60.96 77.31,66.36 v77.15,66.52
CANL2  (via drill 0.4)
  Top 0.406: K1.A8 18.26,58.9 v17.78,58.42 | v17.78,50.8 16.99,50.8 K1.H8 | K1.B8 18.26,44.93 v17.78,44.45 | v17.78,36.83 16.99,36.83 K1.G8 | K1.C8 18.57,30.96 v17.78,31.75 | K1.F8 16.99,22.07 v17.78,22.86 | K1.D8 18.57,16.99 v17.78,17.78 | K1.E8 16.99,8.1 v17.78,8.89 | v82.55,64.77 81.92,64.14 K4.B8 75.88,64.14 | v82.55,72.39 84.45,72.39 K4.A8 | 75.88,64.14 75.72,64.14 | v25.4,62.23 v34.29,62.23 | JP1.1 68.78,64.49 70.01,65.72 74.3,65.72 75.88,64.14
  Bottom 0.406: v17.78,58.42 v17.78,50.8 v17.78,44.45 v17.78,36.83 v17.78,31.75 v17.78,22.86 v17.78,17.78 v17.78,8.89 | v82.55,64.77 v82.55,72.39 | K1.A8 22.07,58.9 v25.4,62.23 | v34.29,62.23 63.82,62.23 66.04,64.45 68.71,64.45 JP1.1
CANRX  (via drill 0.4)
  Top 0.254: U$1.2 86.04,81.28 86.52,81.76 v86.52,82.87 | v66.83,82.39 63.34,82.39 61.75,80.8 61.75,76.65 IC1.4
  Bottom 0.254: v86.52,82.87 73.82,82.87 72.07,84.61 70.33,84.61 69.06,83.34 67.79,83.34 v66.83,82.39
CANTX  (via drill 0.4)
  Top 0.254: v86.68,80.01 U$1.1
  Top 0.406: IC1.1 65.47,78.96 v67.63,81.12
  Bottom 0.254: 68.58,82.07 84.61,82.07 v86.68,80.01
  Bottom 0.406: 68.58,82.07 v67.63,81.12
D2  (via drill 0.4)
  Top 0.254: R13.2 59.27,6.77 54.61,11.43 v54.61,66.04
  Top 0.406: R5.2 R13.2
  Bottom 0.254: U$2.5 54.61,84.61 v54.61,66.04
D3
  Top 0.254: R14.2 59.27,22.8 55.4,26.67 55.4,64.77 57.31,66.67 57.31,78.9 56.67,79.53 55.09,79.53 54.45,80.17 54.45,81.92 U$2.6
  Top 0.406: R12.2 R14.2
D4
  Top 0.254: R15.2 59.37,35.66 59.37,37.47 56.04,40.8 56.04,64.29 57.94,66.2 57.94,79.53 56.67,80.8 U$2.7
  Top 0.406: R11.2 R15.2
D5
  Top 0.254: R22.2 48.68,66.46 50.8,68.58 50.8,76.99 52.07,78.26 U$2.8
  Top 0.406: R22.2 R18.1
D6
  Top 0.254: U$2.9 53.34,75.72 52.07,74.45 52.07,40.64 48.68,37.25 R23.2
  Top 0.406: R23.2 R19.1
D7
  Top 0.254: U$2.10 54.61,73.18 52.86,71.44 52.86,26.19 48.68,22.01 R24.2
  Top 0.406: R20.1 R24.2
D8
  Top 0.254: R21.1 R25.2 48.68,8.04 53.34,12.7 53.34,24.13 53.66,24.45 53.66,68.42 U$2.11
D9_1W  (via drill 0.4)
  Top 0.254: v65.56,94.77 74.14,94.77 | 74.14,94.77 IC2.2 | R29.1 73.66,95.25 74.14,94.77
  Bottom 0.254: U$2.12 57.15,68.1 57.63,68.58 57.63,80.96 57.94,81.28 57.94,87.15 v65.56,94.77
GND  (via drill 0.4)
  Top 0.406: R4.2 v64.77,5.08 | R3.2 v64.77,20.32 | R2.2 v64.77,35.56 | R14.1 v57.15,21.59 | R24.1 v50.8,21.59 | R7.1 v43.18,20.32 | R10.1 36.04,95.73 C2.- | R25.1 v50.8,6.35 | R13.1 v57.15,6.35 | R8.1 v43.18,35.56 | R23.1 v50.8,36.83 | R15.1 v57.15,36.83 | R9.1 v43.18,50.8 | R22.1 v50.8,52.07 | R6.1 v43.18,5.08 | C4.2 71.54,93.56 U$2.23 69.37,93.5 68.16,92.29 R27.1 | R1.2 67.47,72.08 v66.83,72.71 | R17.1 v91.12,87.63 | U$1.9 v82.71,90.17 | C3.2 74.14,73.82 v75.09,72.87 | IC3.5 75.98,52.7 R28.1 76.62,54.08 77.15,54.61 77.95,54.61 78.26,54.93 78.26,55.82 | 78.26,55.82 C7.2 | 78.26,55.82 v78.26,57.31 | C6.2 85.09,97.79 | C5.2 85.09,97.79 | 85.09,97.79 v85.09,97 | IC1.2 64.2,77.38 v64.14,78.11
  Top 1.27: K3.B4 K3.A4 | K2.B4 K2.A4
  Top 1.422: MOD1.GNDOUT 37.31,85.88 34.29,88.9 C2.-
  Bottom 0.406: v64.77,5.08 63.5,5.08 | v64.77,20.32 63.5,20.32 | v64.77,35.56 63.5,35.56 | v43.18,20.32 44.45,20.32 | v43.18,35.56 44.45,35.56 | v43.18,50.8 44.45,50.8 | v43.18,5.08 44.45,5.08 | v66.83,72.71 66.83,73.03 66.67,73.18 | v91.12,87.63 92.23,87.63 | v82.71,90.17 81.76,90.17 | v75.09,72.87 75.09,72.23 | v78.26,57.31 78.58,57.31 | v85.09,97 85.09,96.36
  Bottom 1.422: K3.A4 14.28,87.94 16.51,90.17 24.13,90.17 | 24.13,90.17 30.48,90.17 C2.- | K2.A4 14.28,71.43 24.13,81.28 24.13,90.17
  pour Bottom: -25.4,115.57 139.7,115.57 139.7,-21.59 -25.4,-21.59
MCP_OSC1
  Top 0.406: U$1.8 82.39,88.9 81.6,89.69 81.6,92.9 Q1.1 81.7,94.96 C5.1
MCP_OSC2
  Top 0.406: U$1.7 85.88,87.63 86.52,88.27 86.52,93 Q1.2 88.48,94.96 C6.1
MISO  (via drill 0.4)
  Top 0.406: U$1.15 78.11,83.82 79.69,82.23 v79.69,75.41
  Bottom 0.406: v79.69,75.41 73.34,75.41 U$2.15
MOSI  (via drill 0.4)
  Top 0.406: v80.8,74.45 80.8,83.03 78.74,85.09 U$1.14
  Bottom 0.406: U$2.14 71.12,70.8 74.77,74.45 v80.8,74.45
N$1
  Top 0.406: IC1.8 67.4,69.8 R1.1
N$2
  Top 0.406: K4.B3 78.49,70.1 80.01,68.58 80.01,67.69 K4.B6
N$3
  Top 0.406: R28.2 81.92,53.34 85.88,57.31 91.06,57.31 CON2.T2 CON2.T1
N$4  (via drill 0.4)
  Top 0.254: 50.67,92.58 50.77,92.58 v51.12,92.23 | v62.23,93.66 R26.2
  Top 0.406: LED9.A 42.1,92.58 J9.2 50.67,92.58
  Top 1.422: MOD1.V+IN 19.05,76.2 22.86,80.01 22.86,88.9 C1.+ 21.59,97.79 45.72,97.79 48.26,95.25 J9.2
  Bottom 0.254: v51.12,92.23 60.8,92.23 v62.23,93.66
N$5
  Top 1.422: D1.A 31.41,55.08 J1.2
N$6
  Top 0.406: K4.A6 89.53,70.48 90.17,69.85 90.17,67.31 89.53,66.67 K4.A3
N$7
  Top 1.422: D2.A 31.41,39.84 J2.2
N$9
  Top 0.406: R10.2 40.54,93.56 LED9.K
N$10  (1 unrouted)
  Top 1.422: D9.A 76.54,39.71 80.01,43.18
N$11
  Top 1.422: D11.A 76.54,9.36 J7.2
N$12
  Top 1.422: D3.A 31.41,24.6 J3.2
N$13
  Top 0.406: LED1.K R2.1
N$14
  Top 0.406: LED2.K R3.1
N$15
  Top 0.406: LED3.K R4.1
N$20
  Top 0.406: LED5.K R6.2
N$21
  Top 0.406: R7.2 LED6.K
N$22
  Top 1.422: D8.A 31.41,9.36 J4.2
N$23
  Top 0.406: LED7.K R8.2
N$24
  Top 0.406: R9.2 LED8.K
N$26
  Top 1.422: D10.A 76.54,24.6 J6.2
N$29
  Top 0.406: LED1.A 73.66,34.29 | 73.66,34.29 74.93,33.02 78.4,33.02 D9.C | R11.1 63.08,34.71 64.77,33.02 72.39,33.02 73.66,34.29
  Top 1.422: D9.C 82.55,35.56 J5.11 J5.12
N$30
  Top 0.406: LED2.A 73.66,19.05 | 73.66,19.05 74.93,17.78 78.4,17.78 D10.C | R12.1 63.08,19.47 64.77,17.78 72.39,17.78 73.66,19.05
  Top 1.422: D10.C 80.94,21.25 J5.7 J5.8
N$31
  Top 0.406: 73.66,3.81 74.93,2.54 78.4,2.54 D11.C | LED3.A 73.66,3.81 | 73.66,3.81 72.39,2.54 65.62,2.54 R5.1
  Top 1.422: D11.C 80.94,9.82 82.55,11.43 J5.3 J5.4
P1
  Top 0.406: D1.C 27.01,49.19 27.94,48.26 33.02,48.26 34.29,49.53 | LED8.A 34.29,49.53 | 34.29,49.53 35.56,48.26 43.18,48.26 44.45,49.53 44.45,50.38 R18.2
  Top 0.813: K1.H3 K1.A6 23.65,56.36 24.13,55.88 24.13,53.88 K1.A3 | K1.H6 K1.A3 | K1.A3 25.26,52.55 D1.C
P2
  Top 0.406: 34.29,34.29 33.02,33.02 29.55,33.02 D2.C | LED7.A 34.29,34.29 | 34.29,34.29 35.56,33.02 42.33,33.02 R19.2
  Top 0.813: K1.G3 K1.B6 23.65,42.39 24.13,41.91 24.13,39.91 K1.B3 | K1.G6 K1.B3 | K1.B3 23.99,38.58 D2.C
P3
  Top 0.406: 34.29,19.05 33.02,17.78 29.55,17.78 D3.C | LED6.A 34.29,19.05 | 34.29,19.05 35.56,17.78 42.33,17.78 R20.2
  Top 0.813: K1.F3 K1.C6 23.65,28.42 24.13,27.94 24.13,25.94 K1.C3 | K1.F6 K1.C3 | K1.C3 24.92,24.61 26.67,22.86 26.67,20.66 D3.C
P4
  Top 0.406: LED5.A 34.29,3.81 | 34.29,3.81 33.02,2.54 29.55,2.54 D8.C | R21.2 44.87,4.23 43.18,2.54 35.56,2.54 34.29,3.81
  Top 0.813: K1.E6 K1.D3 | K1.E3 K1.D6 23.65,14.45 24.13,13.97 24.13,11.97 K1.D3 | K1.D3 24.92,10.64 26.67,8.89 26.67,5.42 D8.C
P5V  (via drill 0.4)
  Top 0.254: R29.2 74.35,98 75.25,98.9 77.79,98.9 78.74,97.95 78.74,94.3 IC2.3 | IC1.3 62.93,75.5 63.5,74.93 65.88,74.93 66.52,75.56 69.06,75.56 70.17,74.45 72.39,74.45 72.71,74.77
  Top 0.406: IC2.3 74.77,92.23 74.45,91.92 73.72,91.92 C4.1 73.66,90.96 U$2.21 | C3.1 74.14,78.83 U$1.18 v76.99,80.01 | C7.1 75.98,56.52 v74.77,56.52 IC3.8 | v70.01,56.52 69.06,56.52 v62.23,63.34 | v86.04,78.74 v81.76,78.74 82.23,79.22 82.23,83.66 80.96,84.93 v80.96,85.88 | v88.27,78.74 v91.12,78.74
  Top 0.61: v72.71,67.15 72.71,74.77 72.71,76.2 73.18,76.68 74.08,76.68 C3.1
  Top 1.422: C2.+ 29.21,83.34 MOD1.V+OUT1 MOD1.V+OUT2 36.04,67.31 17.78,67.31 16.51,68.58 16.51,69.85 15.24,71.12 15.24,78.74 | 15.24,78.74 16.51,80.01 16.51,86.36 15.24,87.63 15.24,93.98 14.28,94.94 K3.A1 K3.B1 | K2.B1 K2.A1 14.93,78.43 15.24,78.74
  Bottom 0.406: v74.77,56.52 v70.01,56.52 | v62.23,63.34 62.23,64.14 62.31,64.85 | JP4.1 96.68,78.9 96.52,78.74 v91.12,78.74 | v76.99,80.01 78.26,78.74 v81.76,78.74 | v86.04,78.74 v88.27,78.74 | U$2.21 71.28,88.42 72.55,89.69 80.17,89.69 80.96,88.9 v80.96,85.88
  Bottom 0.61: 62.31,64.85 64.85,64.85 66.52,66.52 72.07,66.52 v72.71,67.15
  Bottom 1.27: MOD1.V+OUT1 39.37,69.85 44.45,64.77 62.23,64.77 62.31,64.85
P24P  (3 unrouted)
  Bottom 3.81: 50.8,43.18 57.15,43.18 | 50.8,27.94 57.15,27.94 | 50.8,12.7 57.15,12.7
  pour Top: -36.83,140.97 173.99,140.97 173.99,-57.15 -36.83,-57.15
RESET  (via drill 0.4)
  Top 0.254: U$1.17 v77.15,81.28 | v60.17,87.63 v60.17,90.96
  Bottom 0.254: v77.15,81.28 74.14,81.28 72.39,79.53 65.56,79.53 64.29,80.8 62.07,80.8 61.44,81.44 61.44,86.36 v60.17,87.63 | v60.17,90.96 U$2.3
RS485_A  (via drill 0.4)
  Top 0.406: IC3.6 v74.93,53.98
  Bottom 0.406: v74.93,53.98 82.39,53.98 83.66,52.7 CON2.7 88.58,52.7 89.69,51.59 89.69,46.04 88.74,45.09 CON2.1
RS485_B  (via drill 0.4)
  Top 0.406: IC3.7 v74.93,55.24 | CON2.2 84.45,46.35 83.66,47.15 83.66,52.39 CON2.8
  Bottom 0.406: v74.93,55.24 83.98,55.24 CON2.8
RX  (via drill 0.4)
  Top 0.254: U$2.2 54.61,93.5 52.86,91.76 52.86,79.85 50.32,77.31 50.32,69.06 47.78,66.52 v47.78,56.52
  Top 0.406: IC3.1 v63.34,56.52
  Bottom 0.254: v47.78,56.52 v59.05,56.52
  Bottom 0.406: v63.34,56.52 v59.05,56.52
SCK
  Top 0.406: U$1.13 73.66,86.36 73.18,85.88 73.18,78.11 72.55,77.47 72.55,77.15 U$2.16
SCL  (via drill 0.4)
  Top 0.254: v73.34,87.15 73.5,87.15 73.66,87 81.6,87 82.87,85.72 86.36,85.72 v87,85.09 | v98.11,81.76 98.11,84.14 JP4.5 | U$2.26 62.23,73.66 60.96,74.93 60.96,80.96 v63.18,83.19
  Bottom 0.254: v73.34,87.15 70.17,87.15 70.01,87.31 U$2.A5 66.36,87.31 63.18,84.14 v63.18,83.19 | v87,85.09 87,84.77 90.01,81.76 v98.11,81.76
SDA  (via drill 0.4)
  Top 0.254: v89.38,86.36 88.42,85.41 87.95,85.41 87.31,86.04 87.31,86.36 86.68,87 83.03,87 81.76,88.27 73.34,88.27 72.23,87.15 70.33,87.15 68.26,85.09 U$2.A4 65.41,87.63 v65.09,87.63 | U$2.25 59.69,69.22 60.48,70.01 60.48,85.57 v62.55,87.63
  Bottom 0.254: JP4.3 95.41,84.3 95.41,86.04 94.61,86.84 92.71,86.84 92.23,86.36 v89.38,86.36 | v62.55,87.63 v65.09,87.63
SS  (via drill 0.4)
  Top 0.406: U$1.16 77.63,82.55 78.58,81.6 78.58,75.09 76.52,73.03 76.36,72.87 73.82,70.33 v73.82,68.1
  Bottom 0.406: U$2.13 v73.82,68.1
TX  (via drill 0.4)
  Top 0.254: v58.9,96.04 58.9,70.64 58.42,68.9 58.42,60.96 60.4,58.98
  Top 0.406: 60.17,59.21 60.4,58.98 61.59,57.78 61.59,56.2 65.09,52.7 IC3.4
  Bottom 0.254: v58.9,96.04 U$2.1

### Text on the board
tPlace: 5V5A